# Altium project PCB_Project.PrjPcb
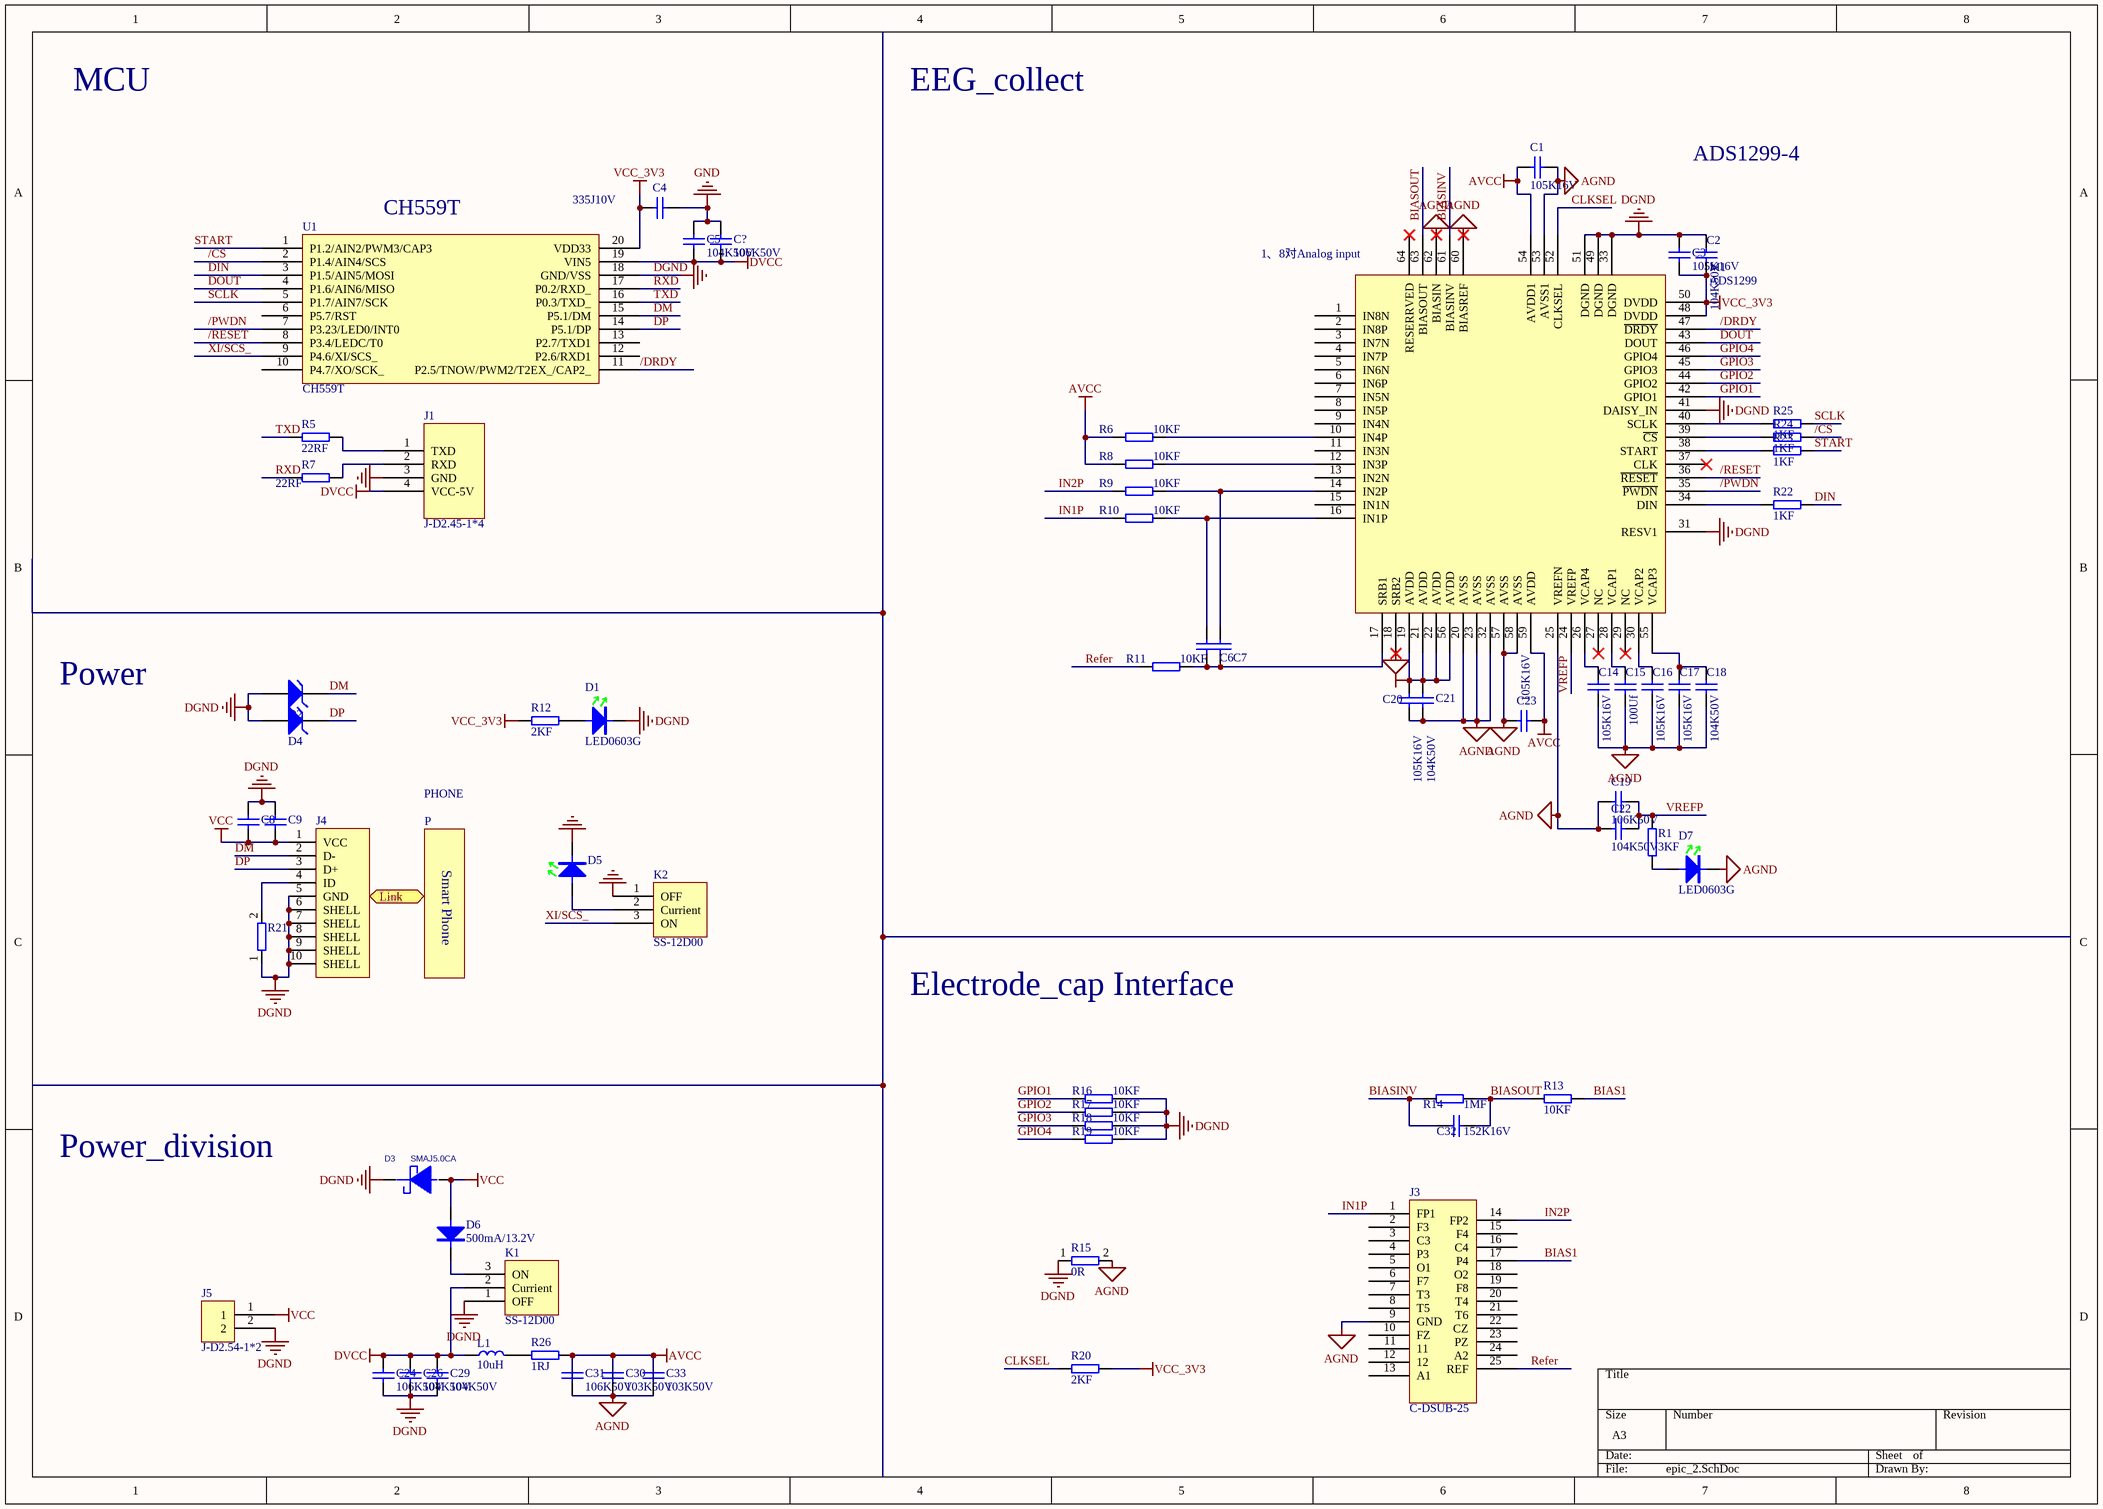
[diagram p0: epic_2.SchDoc]
1 sheet, 67 parts. Net scope: flat (ports and power ports of the same name join across sheets).
Board files: epic2.PcbDoc, jointed board.PcbDoc

## Sheet epic_2.SchDoc
size A3

### Parts
C1  105K16V  [C0603]
C2  104K50V  [C0603]
C3  105K16V  [C0603]
C4  335J10V  [C0603]
C5  104K50V  [C0603]
C6  101K10V  [C0603]  (value not drawn)
C7  101K10V  [C0603]  (value not drawn)
C8  226K25V  [C0805]  (value not drawn)
C9  105K16V  [C0603]  (value not drawn)
C14  105K16V  [C0603]
C15  100Uf  [C1210]
C16  105K16V  [C0603]
C17  105K16V  [C0603]
C18  104K50V  [C0603]
C19  106K50V  [C0603]
C20  105K16V  [C0603]
C21  104K50V  [C0603]
C22  104K50V  [C0603]
C23  105K16V  [C0603]
C24  106K50V  [C0603]
C26  104K50V  [C0603]
C29  104K50V  [C0603]
C30  103K50V  [C0603]
C31  106K50V  [C0603]
C32  152K16V  [C0603]
C33  103K50V  [C0603]
C?  106K50V  [C0603]
D1  LED0603G  [D-LED0603G]
D2  ESDA_TR1/0603  [HS_0603D]  (value not drawn)
D3  SMAJ5.0CA  [DO-214]
D4  ESDA_TR1/0603  [HS_0603D]  (value not drawn)
D5  LED0603G  [D-LED0603G]  (value not drawn)
D6  500mA/13.2V  [D1206]
D7  LED0603G  [D-LED0603G]
J1  J-D2.45-1*4  [D2.54-1*4P]
J3  C-DSUB-25  [C-DSUB-25]
J4  USB-MINI-SOCKET  [MICRO-USB - 5.9]  (value not drawn)
J5  J-D2.54-1*2  [D2.54-1*2P]
K1  SS-12D00  [SS-12D00]
K2  SS-12D00  [SS-12D00]
L1  10uH  [L0805]
M1  ADS1299  [ADS1299-TSQFP50P1200X1200X105-64N]
P  PHONE
R1  3KF  [R0603]
R5  22RF  [R0603]
R6  10KF  [R0603]
R7  22RF  [R0603]
R8  10KF  [R0603]
R9  10KF  [R0603]
R10  10KF  [R0603]
R11  10KF  [R0603]
R12  2KF  [R0603]
R13  10KF  [R0603]
R14  1MF  [R0603]
R15  0R  [R0603]
R16  10KF  [R0603]
R17  10KF  [R0603]
R18  10KF  [R0603]
R19  10KF  [R0603]
R20  2KF  [R0603]
R21  0R  [R0603]  (value not drawn)
R22  1KF  [R0603]
R23  1KF  [R0603]
R24  1KF  [R0603]
R25  1KF  [R0603]
R26  1RJ  [R0603]
U1  CH559T  [TSSOP20]

### Ports
Link

### Nets
AGND: C1.1 C14.2 C15.2 C16.2 C17.2 C18.1 C19.2 C20.2 C21.2 C22.2 C23.2 C30.2 C31.2 C33.2 D7.2 J3.9(GND) M1.18(SRB2) M1.20(AVSS) M1.23(AVSS) M1.25(VREFN) M1.32(AVSS) M1.53(AVSS1) M1.57(AVSS) M1.58(AVSS) M1.60(BIASREF) M1.62(BIASIN) R15.2
AVCC: C1.2 C20.1 C21.1 C23.1 C30.1 C31.1 C33.1 M1.19(AVDD) M1.21(AVDD) M1.22(AVDD) M1.54(AVDD1) M1.56(AVDD) M1.59(AVDD) R6.1 R8.1 R26.1
DGND: C2.2 C3.2 C8.1 C9.1 C24.2 C26.2 C29.2 D1.2 D2.1(A) D3.2(-) D4.1(A) D5.2 J1.3(GND) J4.5(GND) J4.6(SHELL) J4.7(SHELL) J4.8(SHELL) J4.9(SHELL) J4.10(SHELL) J5.2 K1.1(OFF) K2.1(OFF) M1.31(RESV1) M1.33(DGND) M1.41(DAISY_IN) M1.49(DGND) M1.51(DGND) R15.1 R16.2 R17.2 R18.2 R19.2 R21.1 U1.18(GND/VSS)
DVCC: C5.2 C24.1 C26.1 C29.1 C?.2 J1.4(VCC-5V) K1.2(Currient) L1.2 U1.19(VIN5)
GND: C4.1 C5.1 C?.1
VCC: C8.2 C9.2 D3.1(+) D6.1 J4.1(VCC) J5.1
VCC_3V3: C2.1 C3.1 C4.2 M1.48(DVDD) M1.50(DVDD) R12.2 R20.2 U1.20(VDD33)
/CS: R24.2 U1.2(P1.4/AIN4/SCS)
/DRDY: M1.47(~{DRDY}) U1.11(P2.5/TNOW/PWM2/T2EX_/CAP2_)
/PWDN: M1.35(~{PWDN}) U1.7(P3.23/LED0/INT0)
/RESET: M1.36(~{RESET}) U1.8(P3.4/LEDC/T0)
BIAS1: J3.17(P4) R13.2
BIASINV: C32.2 M1.61(BIASINV) R14.1
BIASOUT: C32.1 M1.63(BIASOUT) R13.1 R14.2
CLKSEL: M1.52(CLKSEL) R20.1
DIN: R22.2 U1.3(P1.5/AIN5/MOSI)
DM: D2.2(K) J4.2(D-) U1.15(P5.1/DM)
DOUT: M1.43(DOUT) U1.4(P1.6/AIN6/MISO)
DP: D4.2(K) J4.3(D+) U1.14(P5.1/DP)
GPIO1: M1.42(GPIO1) R16.1
GPIO2: M1.44(GPIO2) R17.1
GPIO3: M1.45(GPIO3) R18.1
GPIO4: M1.46(GPIO4) R19.1
IN1P: J3.1(FP1) R10.1
IN2P: J3.14(FP2) R9.1
Refer: J3.25(REF) R11.1
RXD: R7.2 U1.17(P0.2/RXD_)
SCLK: R25.2 U1.5(P1.7/AIN7/SCK)
START: R23.2 U1.1(P1.2/AIN2/PWM3/CAP3)
TXD: R5.2 U1.16(P0.3/TXD_)
VREFP: C19.1 C22.1 M1.24(VREFP) R1.2
XI/SCS_: K2.3(ON) U1.9(P4.6/XI/SCS_)
NetC6_1: C6.1 M1.16(IN1P) R10.2
NetC6_2: C6.2 C7.2 M1.17(SRB1) R11.2
NetC7_1: C7.1 M1.14(IN2P) R9.2
NetC14_1: C14.1 M1.26(VCAP4)
NetC15_1: C15.1 M1.28(VCAP1)
NetC16_1: C16.1 M1.30(VCAP2)
NetC17_1: C17.1 C18.2 M1.55(VCAP3)
NetD1_1: D1.1 R12.1
NetD5_1: D5.1 K2.2(Currient)
NetD6_2: D6.2 K1.3(ON)
NetD7_1: D7.1 R1.1
NetJ1_1: J1.1(TXD) R5.1
NetJ1_2: J1.2(RXD) R7.1
NetJ4_4: J4.4(ID) R21.2
NetL1_1: L1.1 R26.2
NetM1_10: M1.10(IN4P) R6.2
NetM1_12: M1.12(IN3P) R8.2
NetM1_34: M1.34(DIN) R22.1
NetM1_38: M1.38(START) R23.1
NetM1_39: M1.39(~{CS}) R24.1
NetM1_40: M1.40(SCLK) R25.1

Not connected (* = marked no-connect by the designer): J3 2(F3) 3(C3) 4(P3) 5(O1) 6(F7) 7(T3) 8(T5) 10(FZ) 11 12 13(A1) 15(F4) 16(C4) 18(O2) 19(F8) 20(T4) 21(T6) 22(CZ) 23(PZ) 24(A2); M1 1(IN8N) 2(IN8P) 3(IN7N) 4(IN7P) 5(IN6N) 6(IN6P) 7(IN5N) 8(IN5P) 9(IN4N) 11(IN3N) 13(IN2N) 15(IN1N) 27(NC)* 29(NC)* 37(CLK)* 64(RESERRVED)*; U1 6(P5.7/RST) 10(P4.7/XO/SCK_) 12(P2.6/RXD1) 13(P2.7/TXD1)

### Notes on the sheet
- MCU
- EEG_collect
- ADS1299-4
- (near U1) CH559T
- (near M1) 1、8对Analog input
- Power
- Electrode_cap Interface
- Power_division
- (in symbol PHONE) Smart Phone

### Library data of the parts
C1 C3 C9 C14 C16 C17 C20 C23 = C0603X7R-105K16V: 贴片电容-陶瓷; 规格型号: 1uF±10%_16V_X7R_C0603; 生产商: 风华 三星; 供应商: *; 备注: *
C2 C5 C18 C21 C22 C26 C29 = C0603X7R-104K50V: 贴片电容-陶瓷; 规格型号: 100nF±10%_50V_X7R_C0603; 生产商: 风华 三星; 供应商: *; 备注: *
C4 = C0603X7R-335J10V: 贴片电容-陶瓷
C6 C7 = C0603X7R-101K10V: 贴片电容-陶瓷; 规格型号: 100pF±10%_10V_X7R_C0603; 生产商: 风华 三星; 供应商: *; 备注: *
C8 = C0805X7R-226K25V: 贴片电容-陶瓷; 规格型号: 22uF±10%_25V_X7R_C0805; 生产商: 风华 三星; 供应商: *; 备注: *
C15 = C1210钽电容 --100UF--B3528: C1210-100UF
C19 C24 C31 C? = C0603X7R-106K50V: 贴片电容-陶瓷; 规格型号: 10uF±10%_50V_X7R_C0603; 生产商: 风华 三星; 供应商: *; 备注: *
C30 C33 = C0603X7R-103K50V: 贴片电容-陶瓷; 规格型号: 10nF±10%_50V_X7R_C0603; 货品编码: 301075; 生产商: 风华 三星; 供应商: *; 备注: *
C32 = C0603X7R-152K16V: 贴片电容-陶瓷
D1 D5 D7 = DLED-0603-G: 贴片二极管-LED; 规格型号: 0603-GREEN; 货品编码: 无样品无编码; 生产商: *; 供应商: *; 备注: *
D2 D4 = D Zener: Zener Diode; Published: *; LatestRevisionDate: *; LatestRevisionNote: *; PackageReference: *; Publisher: *
D6 = 1206MSD: 500mA/13.2V 自恢复保险丝
J1 = J-D2.54-1*4单排排母
J3 = C-DSUB-25: C-DSUB-0064
J4 = J-USB-MINI-SOCKET: USB-A卧式插座; 供应商: *; 备注: *
J5 = J-D2.54-1*2单排
K1 K2 = SS-12D00(1P2T) 立式 柄高5MM
L1 = L-0805-10uH: 贴片电感-层叠; 规格型号: L0805-10uH; 货品编码: 351002; 生产商: *; 供应商: *; 备注: *
M1 = ADS1299: ADS1299-S-PQFP-64; ADS1299: S-PQFP-64
R1 = R0603-3KF: 贴片电阻-通用; 生产商: 厚声 国巨; 规格型号: 3K±1%_1/10W_±200ppm_R0603; 货品编码: 无样品无编码; 备注: *; 供应商: *
R5 R7 = R0603-22RF: 贴片电阻-通用; 生产商: 厚声 国巨; 规格型号: 22R±5%_1/10W_±200ppm_R0603; 货品编码: 无样品无编码; 备注: *; 供应商: *
R6 R8-R11 R13 R16-R19 = R0603-10KF: 贴片电阻-通用; 生产商: 厚声 国巨; 规格型号: 10K±1%_1/10W_±200ppm_R0603; 备注: *; 供应商: *
R12 R20 = R0603-2KF: 贴片电阻-通用; 生产商: 厚声 国巨; 规格型号: 2K±1%_1/10W_±200ppm_R0603; 备注: *; 供应商: *
R14 = R0603-1MF: 贴片电阻-通用; value: 1MF 0603贴片电阻-通用; 厂商: 10K±1%_1/10W_±200ppm_R0603 国巨
R15 R21 = R0603-0R: 贴片电阻-通用; 生产商: 厚声 国巨; 规格型号: 0R_1/10W_±200ppm_R0603; 货品编码: 无样品无编码; 备注: *; 供应商: *
R22-R25 = R0603-1KF: 贴片电阻-通用; 生产商: 厚声 国巨; 规格型号: 1K±1%_1/10W_±200ppm_R0603; 货品编码: 无样品无编码; 备注: *; 供应商: *
R26 = R0603-1RJ: 贴片电阻-通用; 生产商: 厚声 国巨; 规格型号: 1R±5%_1/10W_±200ppm_R0603; 货品编码: 无样品无编码; 备注: *; 供应商: *
U1 = CH559T: usb通信
D3 = SMAJ5.0CA: PCB DECAL: DO-214; Value: SMAJ5.0CA